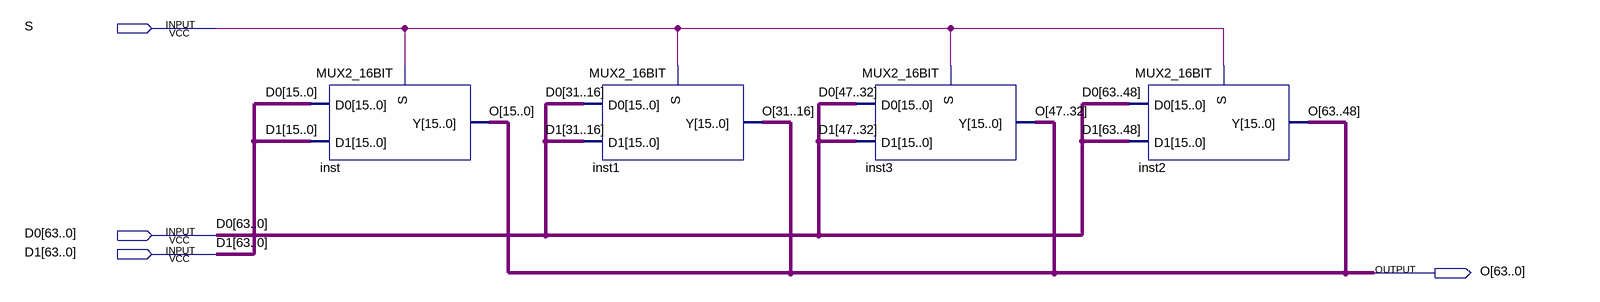
[diagram p0: schematic sheet]
// Quartus schematic MUX2_64bits.bdf as structural Verilog: 4 symbols, 4 pins
module MUX2_64bits (
  input  S,
  input  [63:0] D0,
  input  [63:0] D1,
  output [63:0] O
);

  MUX2_16BIT inst (.S(S), .D1(D1[15:0]), .D0(D0[15:0]), .Y(O[15:0]));
  MUX2_16BIT inst1 (.S(S), .D1(D1[31:16]), .D0(D0[31:16]), .Y(O[31:16]));
  MUX2_16BIT inst3 (.S(S), .D1(D1[47:32]), .D0(D0[47:32]), .Y(O[47:32]));
  MUX2_16BIT inst2 (.S(S), .D1(D1[63:48]), .D0(D0[63:48]), .Y(O[63:48]));
endmodule
